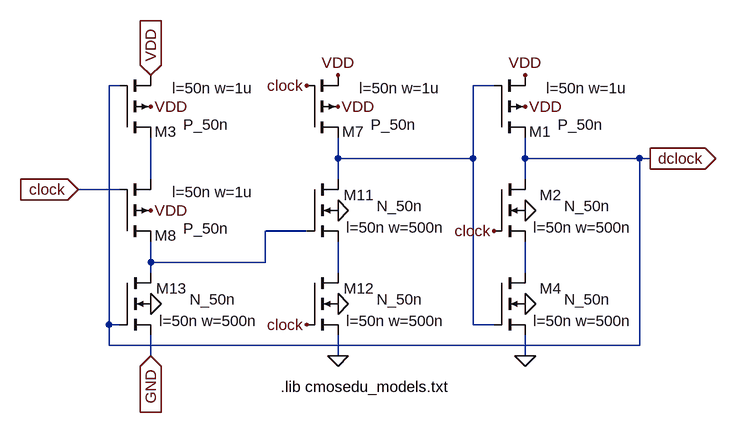
[diagram p0: schematic divide_by_2.asc]
divide_by_2.asc, the LTspice schematic file:
Version 4
SHEET 1 6288 680
WIRE 1104 -128 1104 -496
WIRE 1104 -96 1104 -128
WIRE 1120 -496 1104 -496
WIRE 1120 -336 1056 -336
WIRE 1120 -128 1104 -128
WIRE 1168 -352 1168 -416
WIRE 1168 -224 1168 -256
WIRE 1168 -208 1168 -224
WIRE 1168 -80 1168 -112
WIRE 1344 -224 1168 -224
WIRE 1344 -224 1344 -272
WIRE 1408 -272 1344 -272
WIRE 1456 -384 1456 -416
WIRE 1456 -352 1456 -384
WIRE 1456 -208 1456 -256
WIRE 1456 -80 1456 -112
WIRE 1664 -384 1456 -384
WIRE 1664 -384 1664 -496
WIRE 1664 -128 1664 -384
WIRE 1696 -496 1664 -496
WIRE 1696 -128 1664 -128
WIRE 1744 -384 1744 -416
WIRE 1744 -352 1744 -384
WIRE 1744 -208 1744 -256
WIRE 1744 -80 1744 -112
WIRE 1920 -384 1744 -384
WIRE 1920 -96 1104 -96
WIRE 1920 -96 1920 -384
WIRE 1936 -384 1920 -384
FLAG 1168 -464 VDD
FLAG 1456 -80 0
FLAG 1456 -464 VDD
FLAG 1168 -304 VDD
FLAG 1456 -304 0
FLAG 1456 -160 0
FLAG 1168 -160 0
FLAG 1456 -512 VDD
FLAG 1168 -512 VDD
IOPIN 1168 -512 In
FLAG 1168 -80 GND
IOPIN 1168 -80 In
FLAG 1744 -80 0
FLAG 1744 -464 VDD
FLAG 1744 -304 0
FLAG 1744 -160 0
FLAG 1744 -512 VDD
FLAG 1936 -384 dclock
IOPIN 1936 -384 Out
FLAG 1056 -336 clock
IOPIN 1056 -336 In
FLAG 1408 -496 clock
FLAG 1408 -128 clock
FLAG 1696 -272 clock
SYMBOL pmos4 1120 -416 M180
WINDOW 0 88 9 Right 0
WINDOW 3 168 20 Right 0
WINDOW 123 206 76 Right 0
SYMATTR InstName M3
SYMATTR Value P_50n
SYMATTR Value2 l=50n w=1u
SYMBOL pmos4 1408 -416 M180
WINDOW 0 88 9 Right 0
WINDOW 3 168 20 Right 0
WINDOW 123 206 76 Right 0
SYMATTR InstName M7
SYMATTR Value P_50n
SYMATTR Value2 l=50n w=1u
SYMBOL pmos4 1120 -256 M180
WINDOW 0 88 9 Right 0
WINDOW 3 168 20 Right 0
WINDOW 123 206 76 Right 0
SYMATTR InstName M8
SYMATTR Value P_50n
SYMATTR Value2 l=50n w=1u
SYMBOL nmos4 1408 -352 R0
WINDOW 0 104 24 Right 0
WINDOW 3 179 41 Right 0
WINDOW 123 213 74 Right 0
SYMATTR InstName M11
SYMATTR Value N_50n
SYMATTR Value2 l=50n w=500n
SYMBOL nmos4 1408 -208 R0
WINDOW 0 104 24 Right 0
WINDOW 3 179 41 Right 0
WINDOW 123 213 74 Right 0
SYMATTR InstName M12
SYMATTR Value N_50n
SYMATTR Value2 l=50n w=500n
SYMBOL nmos4 1120 -208 R0
WINDOW 0 104 24 Right 0
WINDOW 3 179 41 Right 0
WINDOW 123 213 74 Right 0
SYMATTR InstName M13
SYMATTR Value N_50n
SYMATTR Value2 l=50n w=500n
SYMBOL pmos4 1696 -416 M180
WINDOW 0 88 9 Right 0
WINDOW 3 168 20 Right 0
WINDOW 123 206 76 Right 0
SYMATTR InstName M1
SYMATTR Value P_50n
SYMATTR Value2 l=50n w=1u
SYMBOL nmos4 1696 -352 R0
WINDOW 0 104 24 Right 0
WINDOW 3 179 41 Right 0
WINDOW 123 213 74 Right 0
SYMATTR InstName M2
SYMATTR Value N_50n
SYMATTR Value2 l=50n w=500n
SYMBOL nmos4 1696 -208 R0
WINDOW 0 104 24 Right 0
WINDOW 3 179 41 Right 0
WINDOW 123 213 74 Right 0
SYMATTR InstName M4
SYMATTR Value N_50n
SYMATTR Value2 l=50n w=500n
TEXT 1368 -32 Left 0 !.lib cmosedu_models.txt

The netlist it stands for:
* divide_by_2.asc
M3 N001 dclock VDD VDD P_50n l=50n w=1u
M7 N003 clock VDD VDD P_50n l=50n w=1u
M8 N002 clock N001 VDD P_50n l=50n w=1u
M11 N003 N002 N004 0 N_50n l=50n w=500n
M12 N004 clock 0 0 N_50n l=50n w=500n
M13 N002 dclock GND 0 N_50n l=50n w=500n
M1 dclock N003 VDD VDD P_50n l=50n w=1u
M2 dclock clock N005 0 N_50n l=50n w=500n
M4 N005 N003 0 0 N_50n l=50n w=500n
.model NMOS NMOS
.model PMOS PMOS
.lib standard.mos
.lib cmosedu_models.txt
.backanno
.end